# Altium schematic sheet RcMPPT-Buck-Supply.SchDoc: RcMPPT-Buck-Supply
size A4; Author: Thomas Hofmann; CompanyName: HTL St. Pölten; Organization: Altium Limited; Address1: RcMPPT; Address2: Frenchs Forest; Address3: NSW; Address4: Australia 2086; DocumentNumber: 2; Revision: 2.0; SheetNumber: 2; SheetTotal: 8
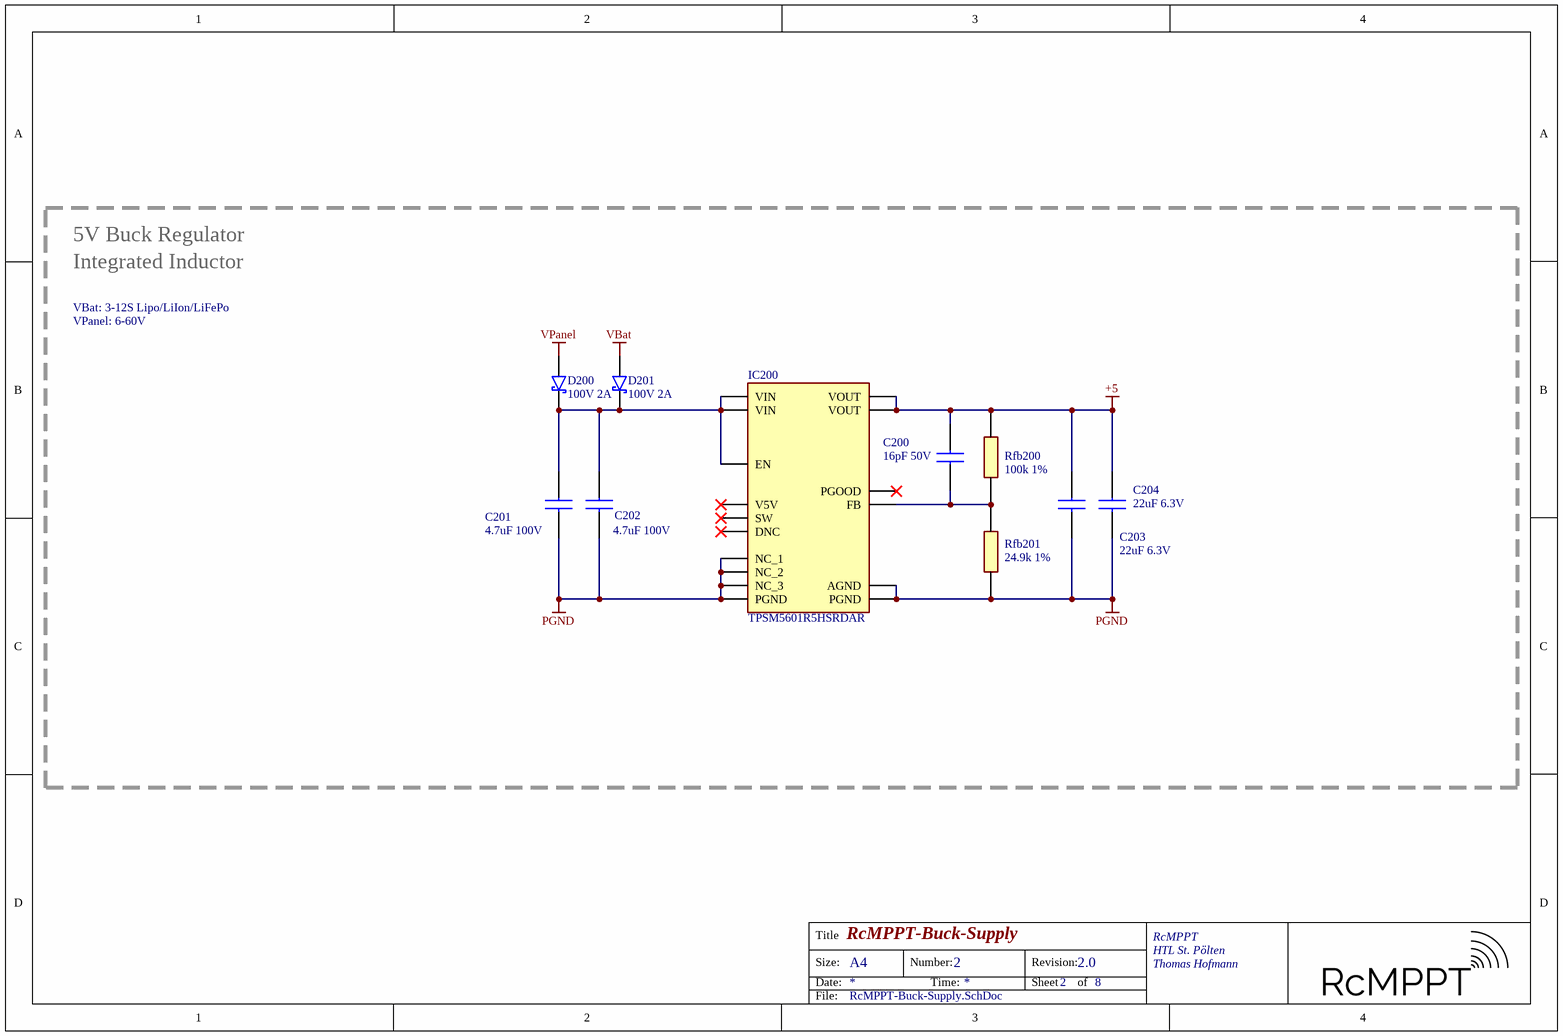
[diagram p0: RcMPPT-Buck-Supply.SchDoc]

## Parts
C200  16pF 50V  [CAPC1608X97N]
C201  4.7uF 100V  [CAPC3225X270N]
C202  4.7uF 100V  [CAPC3225X270N]
C203  22uF 6.3V  [CAPC3225X270N]
C204  22uF 6.3V  [CAPC3225X270N]
D200  100V 2A  [SOD-123FL]
D201  100V 2A  [SOD-123FL]
IC200  TPSM5601R5HSRDAR  [TPSM5601R5HSRDAR]
Rfb200  100k 1%  [RESC1608X50N]
Rfb201  24.9k 1%  [RESC1608X50N]

## Nets
+5: C200.2 C203.2 C204.2 IC200.7(VOUT) IC200.8(VOUT) Rfb200.2
PGND: C201.1 C202.1 C203.1 C204.1 IC200.3(NC_1) IC200.6(NC_2) IC200.10(AGND) IC200.13(NC_3) IC200.15,_16(PGND) IC200.17(PGND) Rfb201.1
VBat: D201.2(A)
VPanel: D200.2(A)
NetC200_1: C200.1 IC200.9(FB) Rfb200.1 Rfb201.2
NetC201_2: C201.2 C202.2 D200.1(K) D201.1(K) IC200.1(VIN) IC200.2(EN) IC200.14(VIN)

Not connected (* = marked no-connect by the designer): IC200 4(SW)* 5(DNC)* 11(V5V)* 12(PGOOD)*

## Notes on the sheet
- 5V Buck Regulator
- VBat: 3-12S Lipo/LiIon/LiFePo
- Integrated Inductor
- VPanel: 6-60V
- Title
- Size:
- Date:
- A4
- Number:
- Time:
- Revision:
- Sheet
- of
- RcMPPT
- File:

## Library data of the parts
C200 = C0603: Capacitor; Height: 0.97
C201-C204 = C1210: Capacitor; Height: 0.97mm
D200 D201 = SCHOTTKY-DIODE: Schottky Diode
IC200 = TPSM5601R5HSRDAR: Integrated Circuit; pin to pad: 15, 16>15+16; Manufacturer_Name: Texas Instruments; Datasheet Link: https://www.ti.com/lit/ds/symlink/tpsm5601r5h.pdf?ts=1622688238120&ref_url=https%253A%252F%252Fcomponentsearchengine.com%252F; Height: 4.1mm; Manufacturer_Part_Number: TPSM5601R5HSRDAR; Mouser Part Number: 595-TPSM5601R5HSRDAR; Mouser Price/Stock: https://www.mouser.co.uk/ProductDetail/Texas-Instruments/TPSM5601R5HSRDAR?qs=DRkmTr78QARQPwPAx4O%252BKQ%3D%3D; Arrow Part Number: TPSM5601R5HSRDAR; Arrow Price/Stock: https://www.arrow.com/en/products/tpsm5601r5hsrdar/texas-instruments?region=nac
Rfb200 Rfb201 = R0603: Resistor; Height: 0.55mm